# EAGLE design ZXUno_Companion_2_SD (EAGLE 7.6.0)
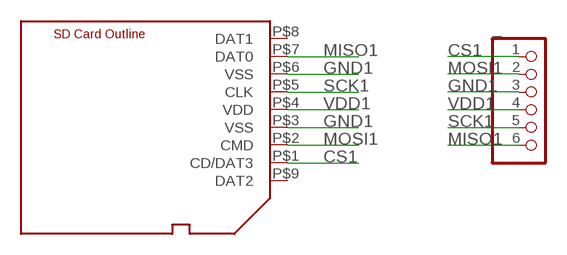
[diagram p0: schematic, sheet 1]

## Parts
_  PINHD-1X6  [1X06]
U$2  SDCARD_PCBCARRIERTDOCU  [SDCARD_PCBCARRIER_DOCU]

## Nets
CS1: _.1 U$2.P$1(CD/DAT3)
GND1: _.3 U$2.P$3(VSS) U$2.P$6(VSS)
MISO1: _.6 U$2.P$7(DAT0)
MOSI1: _.2 U$2.P$2(CMD)
SCK1: _.5 U$2.P$5(CLK)
VDD1: _.4 U$2.P$4(VDD)
Unconnected: U$2.P$8(DAT1) U$2.P$9(DAT2)

## Library data of the parts
_ = pinhead:PINHD-1X6: PIN HEADER
U$2 = microbuilder:SDCARD_PCBCARRIER: Physical PCB representing an SD Card

## Net classes
1 5v: width 0.305 mm
2 GND: width 0.254 mm
3 3.3V: width 0.203 mm

## Board
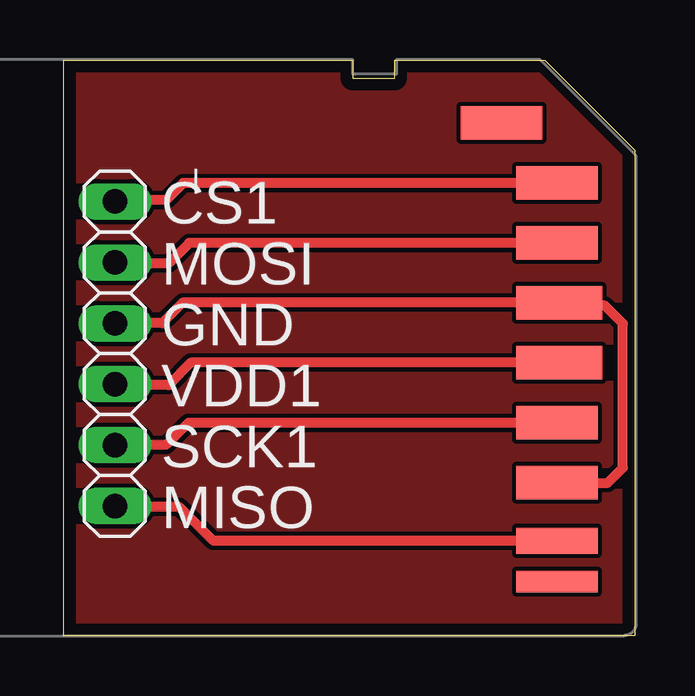
[diagram p1: board, top side]
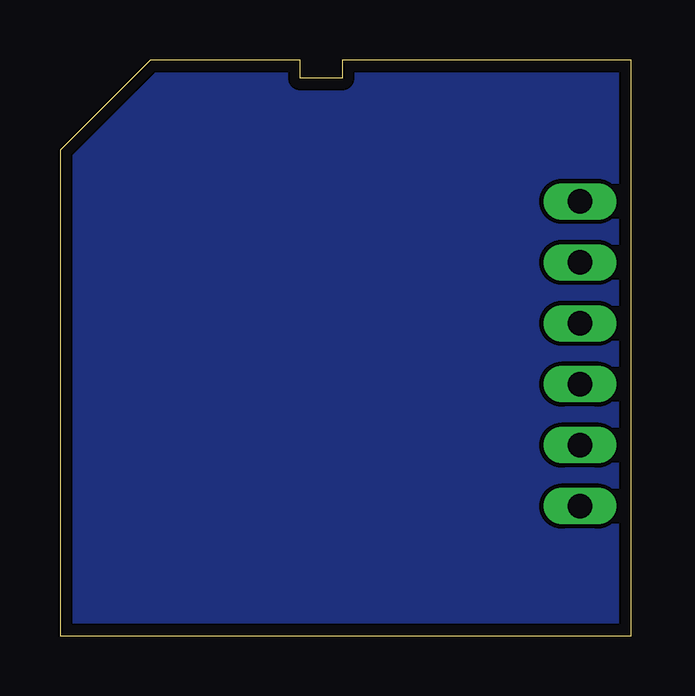
[diagram p2: board, bottom side, seen from below]

Size 23.8 x 24 mm. Coordinates in mm from the lower left corner, seen from the top.
Outline: 23.8,0 0,0 0,24 12.05,24 12.05,23.25 13.8,23.25 13.8,24 20.05,24 23.8,20.25 23.8,0
Copper layers (1*16): Top 0.035mm / dielectric 1.5mm / Bottom 0.035mm
Design rules "EagleRules": minimum track width 7mil, minimum drill 12mil, track to track 7mil, track to pad 7mil, pad to pad 7mil, via to via 7mil, smd to smd 0mil, copper to edge 20mil, drill to drill 10mil, minimum pad ring 10mil, minimum via ring 6mil, stop-mask expansion 2mil, vias tented up to drill 25mil, thermal gap 10mil

### Footprints (pad centres in the part's own frame; a part is rotated, then mirrored left to right if it is on the bottom)
1X06 = drill 1.016 long: 1 -6.35,0; 2 -3.81,0; 3 -1.27,0; 4 1.27,0; 5 3.81,0; 6 6.35,0
SDCARD_PCBCARRIER_DOCU = smd 1.4 x 3.4: P$1 -6.875,0; P$2 -4.375,0; P$5 3.125,0; P$6 5.625,0; P$9 -9.375,-2.3 | smd 1.4 x 3.6: P$3 -1.875,0.1; P$4 0.625,0.1 | smd 1.1 x 3.4: P$7 8.05,0 | smd 0.9 x 3.4: P$8 9.75,0

### Placement (x,y rotation side)
_  2.14,11.75 270 top
U$2  20.55,12 270 top

### Tracks (layer width: path | path; a pad name or v marks a point on that pad's centre or on a via)
CS1
  Top 0.406: U$2.P$1 4.99,18.88 4.27,18.16 2.2,18.16 _.1
GND
  pour Bottom: 23.3,0.5 0.3,0.45 0.3,23.7 19.55,23.75 23.55,19.75 23.3,19.75
  pour Top: 23.3,0.5 0.3,0.45 0.3,23.7 19.55,23.75 23.55,19.75 23.3,19.75
GND1
  Top 0.406: U$2.P$6 22.68,6.38 23.3,7 23.3,13 22.55,13.75 20.78,13.75 U$2.P$3 4.96,13.88 4.12,13.03 2.15,13.03 _.3
MISO1
  Top 0.406: U$2.P$7 6.24,3.95 4.83,5.36 2.18,5.36 _.6
MOSI1
  Top 0.406: U$2.P$2 5.23,16.38 4.37,15.52 2.18,15.52 _.2
SCK1
  Top 0.406: U$2.P$5 5.2,8.88 4.27,7.95 2.15,7.95 _.5
VDD1
  Top 0.406: U$2.P$4 5.31,11.38 4.37,10.44 2.18,10.44 _.4

### Text on the board
tPlace: CS1 | MOSI | GND | VDD1 | SCK1 | MISO